# Altium schematic sheet Connectors.SchDoc: Dual Feeder -
size Letter; DrawnBy: Mark Harris; Engineer: Mark Harris; Organization: Mark Harris; ProjectName: Dual Feeder Controller
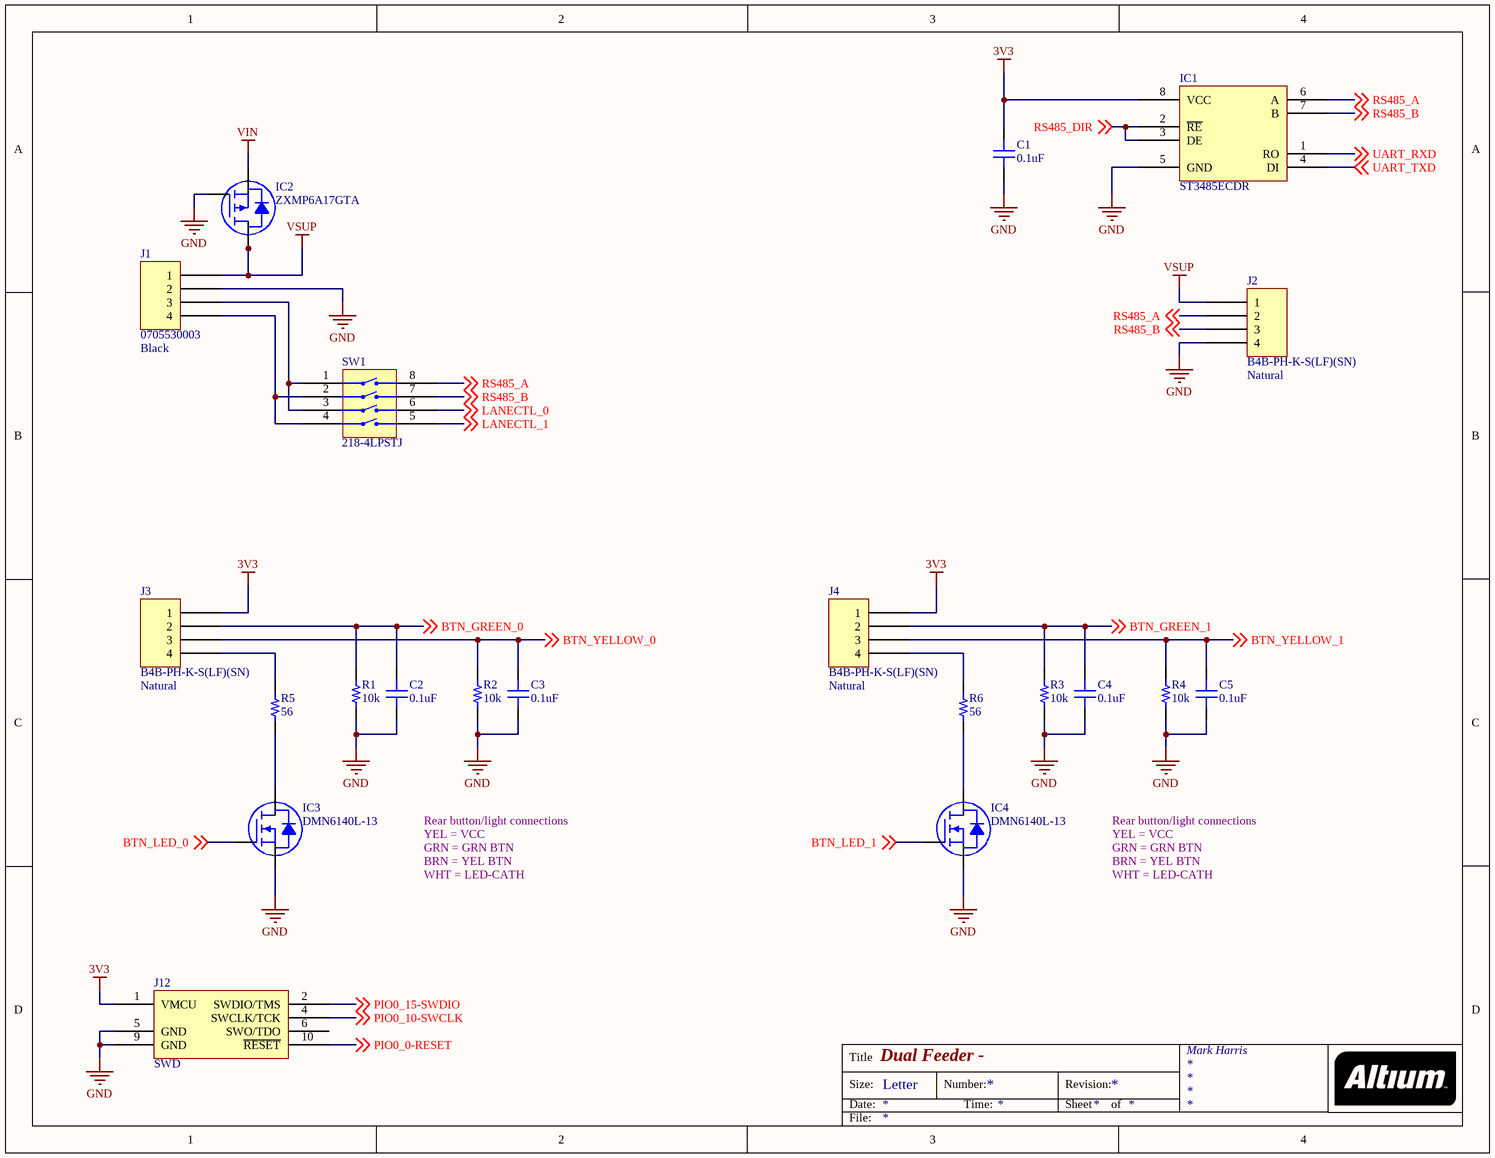
[diagram p0: Connectors.SchDoc]

## Parts
C1  0.1uF  [CAP 0603/1608]
C2  0.1uF  [CAP 0603/1608]
C3  0.1uF  [CAP 0603/1608]
C4  0.1uF  [CAP 0603/1608]
C5  0.1uF  [CAP 0603/1608]
IC1  ST3485ECDR  [ST SOIC-8N]
IC2  ZXMP6A17GTA  [DIODES SOT-223]
IC3  DMN6140L-13  [DIODES SOT-23-3]
IC4  DMN6140L-13  [DIODES SOT-23-3]
J1  0705530003  Colour: Black  [MOLEX SDA-70553-4PIN]
J2  B4B-PH-K-S(LF)(SN)  Colour: Natural  [JST B4B-PH-K]
J3  B4B-PH-K-S(LF)(SN)  Colour: Natural  [JST B4B-PH-K]
J4  B4B-PH-K-S(LF)(SN)  Colour: Natural  [JST B4B-PH-K]
J12  SWD  [10 Pin SWD]  (no BOM)
R1  10k  [RES 0603/1608]
R2  10k  [RES 0603/1608]
R3  10k  [RES 0603/1608]
R4  10k  [RES 0603/1608]
R5  56  [RES 0603/1608]
R6  56  [RES 0603/1608]
SW1  218-4LPSTJ  [CTS 218-4LPJ]

## Nets
3V3: C1.1 IC1.8(VCC) J3.1 J4.1 J12.1(VMCU)
GND: C1.2 C2.2 C3.2 C4.2 C5.2 IC1.5(GND) IC2.1(G) IC3.3(S) IC4.3(S) J1.2 J2.4 J12.5(GND) J12.9(GND) R1.1 R2.1 R3.1 R4.1
VIN: IC2.3(S)
VSUP: IC2.2(D) IC2.4(D) J1.1 J2.1
BTN_GREEN_0: C2.1 J3.2 R1.2 ; off-sheet BTN_GREEN_0
BTN_GREEN_1: C4.1 J4.2 R3.2 ; off-sheet BTN_GREEN_1
BTN_LED_0: IC3.1(G) ; off-sheet BTN_LED_0
BTN_LED_1: IC4.1(G) ; off-sheet BTN_LED_1
BTN_YELLOW_0: C3.1 J3.3 R2.2 ; off-sheet BTN_YELLOW_0
BTN_YELLOW_1: C5.1 J4.3 R4.2 ; off-sheet BTN_YELLOW_1
LANECTL_0: SW1.6 ; off-sheet LANECTL_0
LANECTL_1: SW1.5 ; off-sheet LANECTL_1
PIO0_0-RESET: J12.10(~{RESET}) ; off-sheet PIO0_0-RESET
PIO0_10-SWCLK: J12.4(SWCLK/TCK) ; off-sheet PIO0_10-SWCLK
PIO0_15-SWDIO: J12.2(SWDIO/TMS) ; off-sheet PIO0_15-SWDIO
RS485_A: IC1.6(A) J2.2 SW1.8 ; off-sheet RS485_A
RS485_B: IC1.7(B) J2.3 SW1.7 ; off-sheet RS485_B
RS485_DIR: IC1.2(~{RE}) IC1.3(DE) ; off-sheet RS485_DIR
UART_RXD: IC1.1(RO) ; off-sheet UART_RXD
UART_TXD: IC1.4(DI) ; off-sheet UART_TXD
NetIC3_2: IC3.2(D) R5.1
NetIC4_2: IC4.2(D) R6.1
NetJ1_3: J1.3 SW1.1(GND) SW1.3(GND)
NetJ1_4: J1.4 SW1.2(GND) SW1.4(GND)
NetJ3_4: J3.4 R5.2
NetJ4_4: J4.4 R6.2

Not connected (* = marked no-connect by the designer): J12 6(SWO/TDO)

## Notes on the sheet
- Rear button/light connections
- YEL = VCC
- GRN = GRN BTN
- BRN = YEL BTN
- WHT = LED-CATH
- Title
- Size:
- Date:
- Letter
- Number:
- Time:
- Revision:
- Sheet
- of
- File:

## Library data of the parts
C1-C5 = CL10B104JB8NNNC: CAP CER 0.1UF 50V X7R 0603; Manufacturer: Samsung Electro-Mechanics America, Inc.; TemperatureRange: -55C ~ 125C; Tolerance: 5%; Value: 0.1uF; Part Number: CL10B104JB8NNNC; PartId: 5416; Supplier 1: Digi-Key; Supplier Part Number 1: 1276-1033-2-ND; ComponentLink1Description: Datasheet; ComponentLink1URL: http://www.samsungsem.com/kr/support/product-search/mlcc/CL10B104JB8NNNC.jsp; ComponentLink2Description: Digi-Key listing; ComponentLink2URL: http://digikey.com/product-detail/en/CL10B104JB8NNNC/1276-1033-2-ND/3886691; TemperatureCoefficient: X7R; Voltage: 50V; Price: 0.0132; Type: -; Device Package: 0603 (1608 Metric)
IC1 = ST3485ECDR: IC TXRX RS422/485 15MBPS 8SO; Manufacturer: STMicroelectronics; Protocol: RS422, RS485; Number of Drivers/Receivers: 1/1; Duplex: Half; Receiver Hysteresis: 70mV; Voltage - Supply: 3 V ~ 3.6 V; Part Number: ST3485ECDR; PartId: 16405; Supplier 1: Digi-Key; Supplier Part Number 1: 497-6540-2-ND; ComponentLink1Description: Datasheet; ComponentLink1URL: http://www.st.com/content/ccc/resource/technical/document/datasheet/be/f4/e5/fd/b0/df/40/72/CD00003137.pdf/files/CD00003137.pdf/jcr:content/translations/en.CD00003137.pdf; ComponentLink2Description: Digi-Key Listing; ComponentLink2URL: https://www.digikey.com/product-detail/en/stmicroelectronics/ST3485ECDR/497-6540-2-ND/1039255; Price: 0.6076; Type: Transceiver; Device Package: 8-SOIC (0.154", 3.90mm Width); Operating Temperature: 0C ~ 70C; Data Rate: 15Mbps
IC2 = ZXMP6A17GTA: MOSFET P-CH 60V 3A SOT223; Manufacturer: Diodes Incorporated; Rds On (Max) at Id, Vgs: 125 mOhm @ 2.2A, 10V; Vgs(th) (Max) at Id: 1V @ 250uA; Gate Charge (Qg): 17.7nC @ 10V; Input Capacitance (Ciss) at Vds: 637pF @ 30V; Power - Max: 2W; Current Continuous Drain: 3A (Ta); Part Number: ZXMP6A17GTA; PartId: 8208; Supplier 1: Digi-Key; Supplier Part Number 1: ZXMP6A17GTR-ND; ComponentLink1Description: Datasheet; ComponentLink1URL: http://www.diodes.com/_files/datasheets/ZXMP6A17G.pdf; ComponentLink2Description: Digi-Key Listing; ComponentLink2URL: http://www.digikey.com/product-detail/en/ZXMP6A17GTA/ZXMP6A17GTR-ND/560634; Price: 0.304; Type: MOSFET P-Channel, Metal Oxide; Device Package: TO-261-4, TO-261AA; Drain to Source Voltage (Vdss): 60V; Features: Standard
IC3 IC4 = DMN6140L-13: MOSFET N-CH 60V 1.6A SOT23; Manufacturer: Diodes Incorporated; Rds On (Max) at Id, Vgs: 140 mOhm @ 1.8A, 10V; Vgs(th) (Max) at Id: 20V; Gate Charge (Qg): 8.6nC @ 10V; Input Capacitance (Ciss) at Vds: 315pF @ 40V; Current Continuous Drain: 1.6A (Ta); Part Number: DMN6140L-13; PartId: 29565; Supplier 1: Digi-Key; Supplier Part Number 1: DMN6140L-13DICT-ND; ComponentLink1Description: Datasheet; ComponentLink1URL: http://diodes.com/_files/datasheets/DMN6140L.pdf; ComponentLink2Description: Digi-Key Listing; ComponentLink2URL: https://www.digikey.com/product-detail/en/diodes-incorporated/DMN6140L-13/DMN6140L-13DICT-ND/5218250; Price: 0.51; Type: N-Channel; Device Package: TO-236-3, SC-59, SOT-23-3; Drain to Source Voltage (Vdss): 60V
J1 = 0705530003: CONN HEADER 4POS .100 R/A GOLD; Manufacturer: Molex, LLC; Pitch: 0.100" (2.54mm); Number Of Positions: 4; Part Number: 0705530003; PartId: 7806; Supplier 1: Digi-Key; Supplier Part Number 1: WM4902-ND; ComponentLink1Description: Datasheet; ComponentLink1URL: http://www.molex.com/pdm_docs/sd/705530002_sd.pdf; ComponentLink2Description: Digi-Key Listing; ComponentLink2URL: http://www.digikey.ca/product-detail/en/0705530003/WM4902-ND/114959; Price: 1.58; Type: Through Hole, Right Angle; Contact Finish: Gold; Fastening Type: Latch Holder; Number Of Rows: 1; Series: 70553
J2-J4 = B4B-PH-K-S(LF)(SN): CONN HEADER PH TOP 4POS 2MM; Manufacturer: JST Sales America Inc.; Pitch: 0.079" (2.00mm); Number Of Positions: 4; Part Number: B4B-PH-K-S(LF)(SN); PartId: 29449; Supplier 1: Digi-Key; Supplier Part Number 1: 455-1706-ND; ComponentLink1Description: Datasheet; ComponentLink1URL: http://www.jst-mfg.com/product/pdf/eng/ePH.pdf; ComponentLink2Description: Digi-Key Listing; ComponentLink2URL: http://www.digikey.com/product-detail/en/jst-sales-america-inc/B4B-PH-K-S(LF)(SN)/455-1706-ND/926613; Price: 0.24; Type: Header, Shrouded; Contact Finish: Tin; Fastening Type: Detent Lock; Number Of Rows: 1; Series: PH
R1-R4 = ERJ-3GEYJ103V: RES SMD 10K OHM 5% 1/10W 0603; Manufacturer: Panasonic Electronic Components; TemperatureRange: -55C ~ 155C; TemperatureCoefficient: 200ppm/C; PowerRating: 0.1W, 1/10W; Value: 10k; Part Number: ERJ-3GEYJ103V; PartId: 11175; Supplier 1: Digi-Key; Supplier Part Number 1: P10KGTR-ND; ComponentLink1Description: Datasheet; ComponentLink1URL: http://industrial.panasonic.com/www-cgi/jvcr13pz.cgi?E+PZ+3+AOA0001+ERJ3GEYJ103V+7+WW; ComponentLink2Description: Digi-Key Listing; ComponentLink2URL: https://www.digikey.com/product-detail/en/panasonic-electronic-components/ERJ-3GEYJ103V/P10KGTR-ND/135662; Tolerance: 5%; Price: 0.002; Device Package: 0603 (1608 Metric)
R5 R6 = ERJ-3GEYJ560V: RES SMD 56 OHM 5% 1/10W 0603; Manufacturer: Panasonic Electronic Components; TemperatureRange: -55C ~ 155C; TemperatureCoefficient: 200ppm/C; PowerRating: 0.1W, 1/10W; Value: 56; Part Number: ERJ-3GEYJ560V; PartId: 11243; Supplier 1: Digi-Key; Supplier Part Number 1: P56GTR-ND; ComponentLink1Description: Datasheet; ComponentLink1URL: http://industrial.panasonic.com/www-cgi/jvcr13pz.cgi?E+PZ+3+AOA0001+ERJ3GEYJ560V+7+WW; ComponentLink2Description: Digi-Key Listing; ComponentLink2URL: https://www.digikey.com/product-detail/en/panasonic-electronic-components/ERJ-3GEYJ560V/P56GTR-ND/135638; Tolerance: 5%; Price: 0.002; Device Package: 0603 (1608 Metric)
SW1 = 218-4LPSTJ: SWITCH SLIDE DIP 4POS SPST 25MA 24V; Manufacturer: CTS Electrocomponents; Number Of Positions: 4; Voltage: 24VDC; Actuator Type: Slide (Standard); Actuator Level: Flush, Recessed; Electrical Life: 1,000 Cycles; Part Number: 218-4LPSTJ; PartId: 21129; Supplier 1: Digi-Key; Supplier Part Number 1: CT3109-ND; ComponentLink1Description: Datasheet; ComponentLink1URL: http://www.ctscorp.com/wp-content/uploads/2015/11/218.pdf; ComponentLink2Description: Digi-Key Listing; ComponentLink2URL: http://www.digikey.com/product-detail/en/cts-electrocomponents/218-4LPSTJ/CT3109-ND/5223842; Price: 1.3; TYPE: DIP Switches; Part Status: Active; Series: 218; Circuit: SPST; Current Rating: 25mA; Contact Finish: Gold; Height Above Board: 0.106" (2.70mm); Termination Style: J Lead; Body Material: -; Mechanical Life: -; Operating Temperature: -55C ~ 85C